# EAGLE design Libelle_SmallBoard (EAGLE 9.6.2)
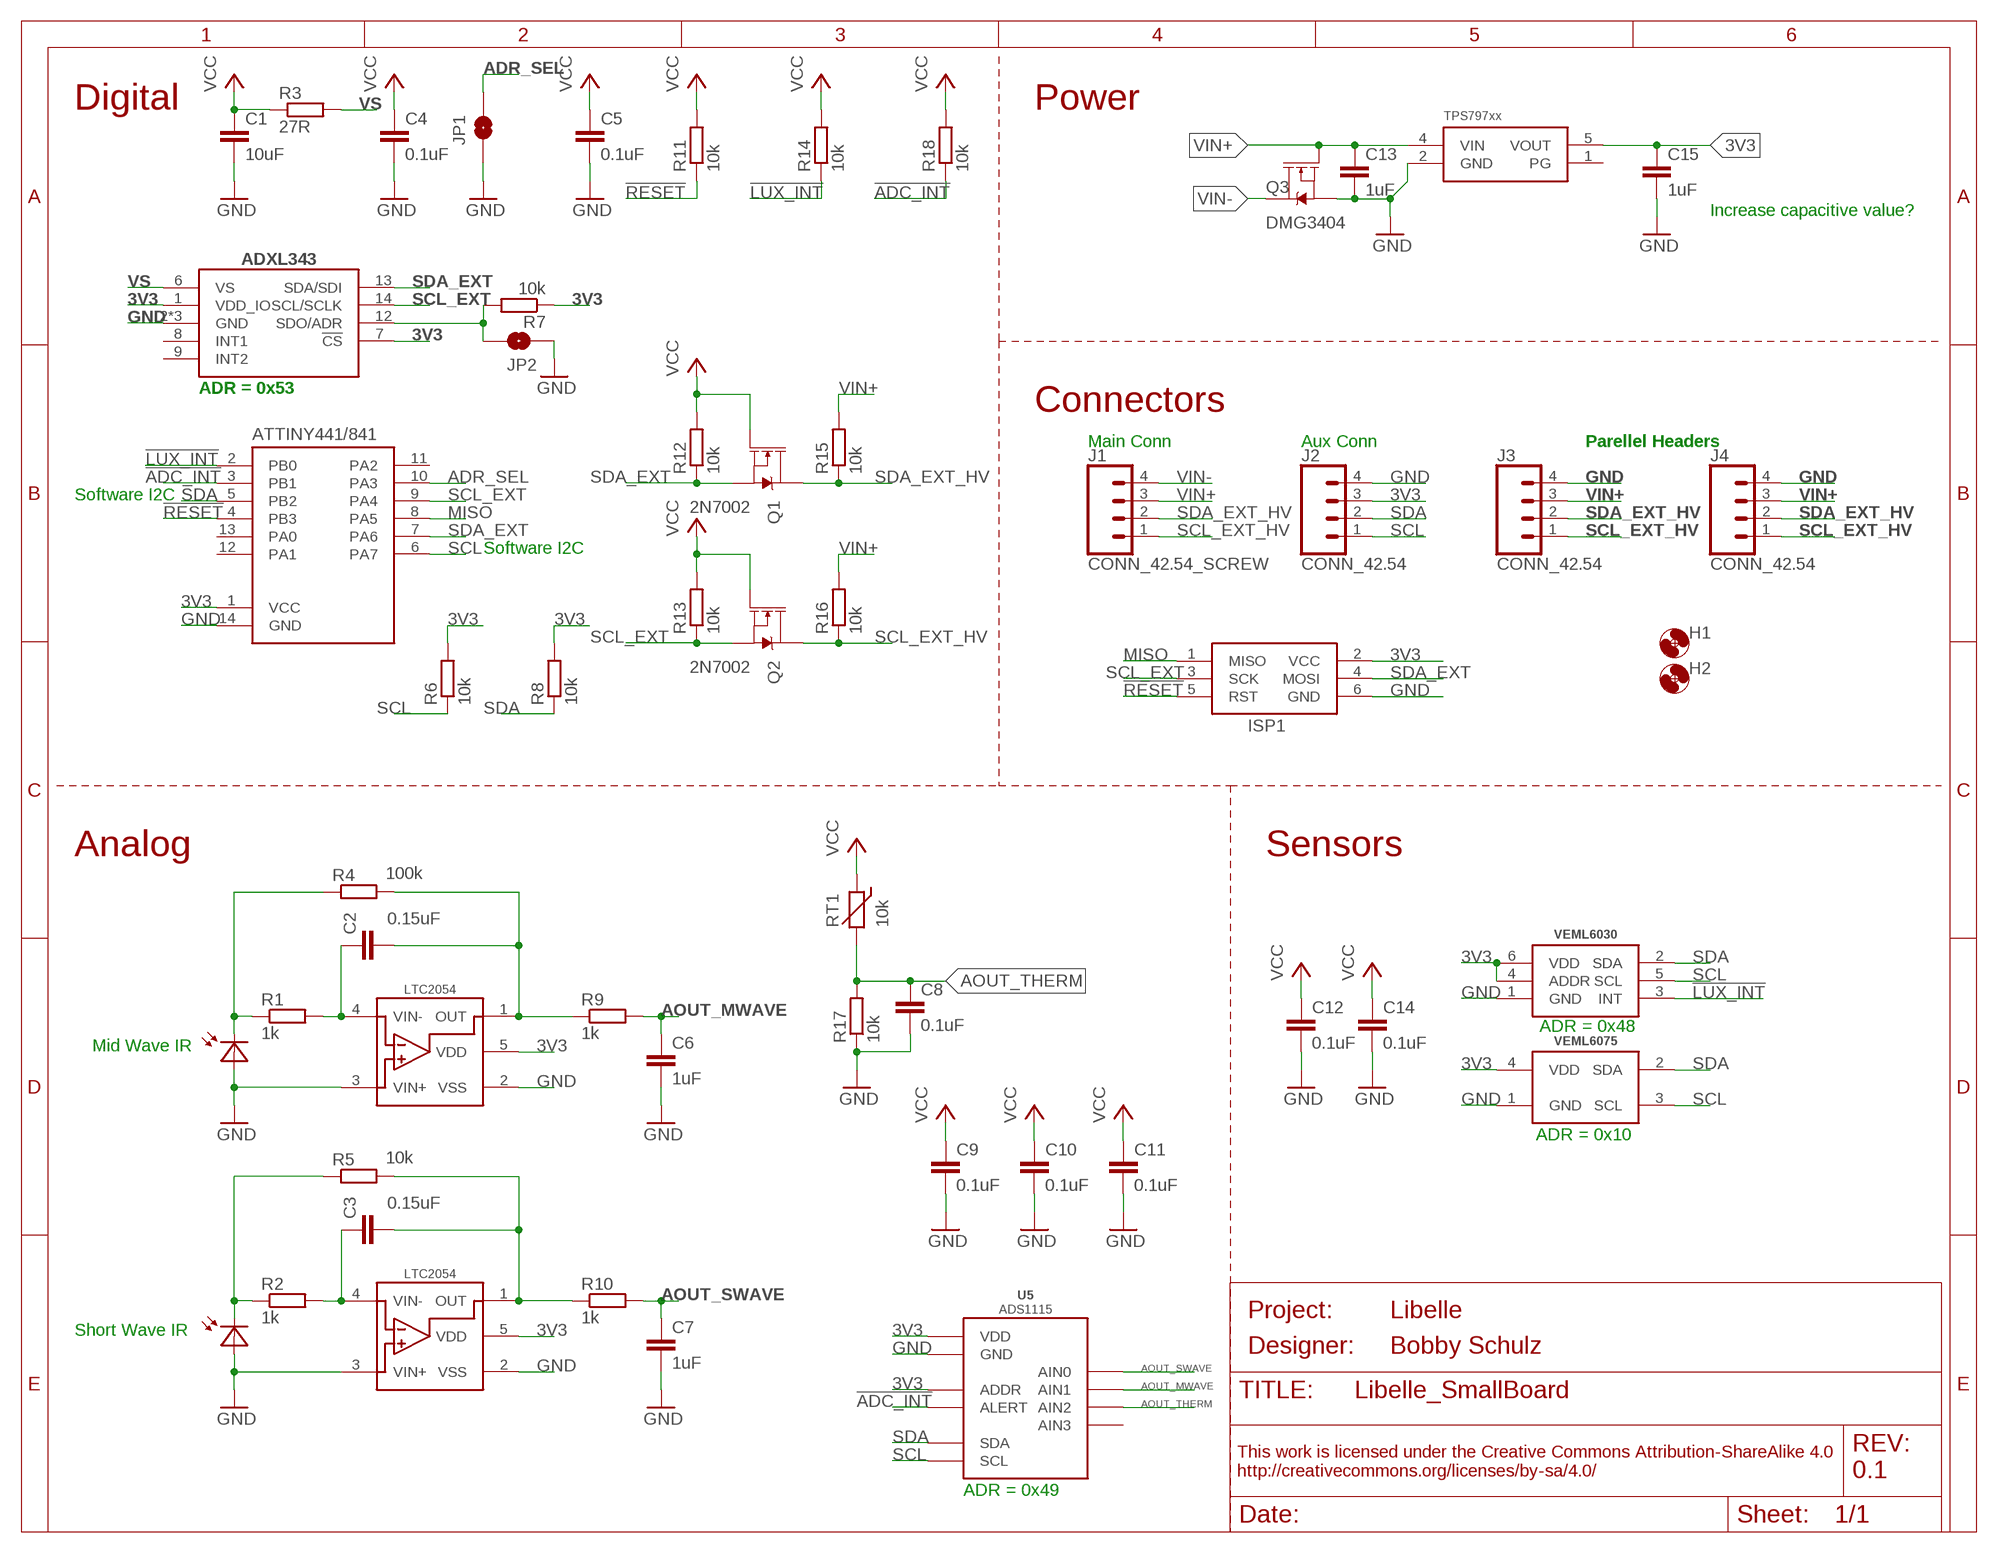
[diagram p0: schematic, sheet 1]
FRAME1 (FRAME_A_L): DESIGNER: Bobby Schulz; PROJECT: Libelle; REV: 0.1

## Parts
C1  10uF  C-EU10UFC0805  [C0805]
C2  0.15uF  C-EU0.15UFC0603  [C0603]
C3  0.15uF  C-EU0.15UFC0603  [C0603]
C4  0.1uF  C-EU0.1UFC0603  [C0603]
C5  0.1uF  C-EU0.1UFC0603  [C0603]
C6  1uF  C-EU1UFC0603  [C0603]
C7  1uF  C-EU1UFC0603  [C0603]
C8  0.1uF  C-EU0.1UFC0603  [C0603]
C9  0.1uF  C-EU0.1UFC0603  [C0603]
C10  0.1uF  C-EU0.1UFC0603  [C0603]
C11  0.1uF  C-EU0.1UFC0603  [C0603]
C12  0.1uF  C-EU0.1UFC0603  [C0603]
C13  1uF  C-EU1UFC0603  [C0603]
C14  0.1uF  C-EU0.1UFC0603  [C0603]
C15  1uF  C-EU1UFC0603  [C0603]
D1  PHOTODIODESD003-151-001  [D1206]
D2  PHOTODIODEVEMD1060  [D0805]
H1  MOUNTING_HOLE4_NP  [4_40]
H2  MOUNTING_HOLE4_NP  [4_40]
ISP1  AVRISP-6  [AVRISP]
J1  CONN_42.54_SCREW  [1X04_SCREW]
J2  CONN_42.54  [1X04]
J3  CONN_42.54  [1X04]
J4  CONN_42.54  [1X04]
JP1  JUMPER-SMT_2_NO_SILK  [SMT-JUMPER_2_NO_SILK]
JP2  JUMPER-SMT_2_NO_SILK  [SMT-JUMPER_2_NO_SILK]
Q1  2N7002  MOSFET-NCH-2N7002PW  [SOT323]
Q2  2N7002  MOSFET-NCH-2N7002PW  [SOT323]
Q3  DMG3404  MOSFET-NCH-DMG3404L  [SOT23-3]
R1  1k  R-EU_P1KR0603  [R0603]
R2  1k  R-EU_P1KR0603  [R0603]
R3  27R  R-EU_27R0603  [R0603]
R4  100k  R-EU_P100KR0603  [R0603]
R5  10k  R-EU_P10KR0603  [R0603]
R6  10k  R-EU_10KR0603  [R0603]
R7  10k  R-EU_10KR0603  [R0603]
R8  10k  R-EU_10KR0603  [R0603]
R9  1k  R-EU_P1KR0603  [R0603]
R10  1k  R-EU_P1KR0603  [R0603]
R11  10k  R-EU_10KR0603  [R0603]
R12  10k  R-EU_10KR0603  [R0603]
R13  10k  R-EU_10KR0603  [R0603]
R14  10k  R-EU_10KR0603  [R0603]
R15  10k  R-EU_10KR0603  [R0603]
R16  10k  R-EU_10KR0603  [R0603]
R17  10k  R-EU_P10KR0603  [R0603]
R18  10k  R-EU_10KR0603  [R0603]
RT1  10k  THERMISTOR10K  [R0603]
U1  ADXL343  [LGA-14]
U2  ATTINY441/841841  [SOIC_14]
U3  LTC2054  [SOT23-5]
U4  LTC2054  [SOT23-5]
U5  ADS1115  [VSSOP_10]
U6  TPS79733  [DCK_R-PDSO-G5]
U7  VEML6030  [VEML6030]
U8  VEML6075  [VEML6075]

## Nets
3V3: C1.1 C4.1 C5.1 C9.1 C10.1 C11.1 C12.1 C14.1 C15.1 ISP1.2(VCC) J2.3 Q1.1(G) Q2.1(G) R3.1 R6.2 R7.1 R8.2 R11.2 R12.2 R13.2 R14.2 R18.2 RT1.1 U1.1(VDD_IO) U1.7(!CS) U2.1(VCC) U3.5(VDD) U4.5(VDD) U5.1(ADDR) U5.8(VDD) U6.5(VOUT) U7.4(ADDR) U7.6(VDD) U8.4(VDD) ; supply symbol labelled VCC
!ADC_INT: R18.1 U2.3(PB1) U5.2(ALERT)
!LUX_INT: R14.1 U2.2(PB0) U7.3(INT)
!RESET: ISP1.5(RST) R11.1 U2.4(PB3)
ADR_SEL: JP1.2 U2.10(PA3)
AOUT_MWAVE: C6.1 R9.2 U5.5(AIN1)
AOUT_SWAVE: C7.1 R10.2 U5.4(AIN0)
AOUT_THERM: C8.1 R17.2 RT1.2 U5.6(AIN2)
GND: C1.2 C4.2 C5.2 C6.2 C7.2 C8.2 C9.2 C10.2 C11.2 C12.2 C13.2 C14.2 C15.2 D1.A D2.A ISP1.6(GND) J2.4 J3.4 J4.4 JP1.1 JP2.1 Q3.2(S) R17.1 U1.2(GND) U1.4(GND) U1.5(GND) U2.14(GND) U3.2(VSS) U3.3(VIN+) U4.2(VSS) U4.3(VIN+) U5.3(GND) U6.2(GND) U7.1(GND) U8.1(GND)
MISO: ISP1.1(MISO) U2.8(PA5)
N$1: JP2.2 R7.2 U1.12(SDO/ADR)
N$8: C3.1 R2.2 U4.4(VIN-)
N$9: D2.C R2.1 R5.1
N$10: D1.C R1.1 R4.1
N$11: C2.1 R1.2 U3.4(VIN-)
N$12: C2.2 R4.2 R9.1 U3.1(OUT)
N$13: C3.2 R5.2 R10.1 U4.1(OUT)
SCL: J2.1 R6.1 U2.6(PA7) U5.10(SCL) U7.5(SCL) U8.3(SCL)
SCL_EXT: ISP1.3(SCK) Q2.2(S) R13.1 U1.14(SCL/SCLK) U2.9(PA4)
SCL_EXT_HV: J1.1 J3.1 J4.1 Q2.3(D) R16.1
SDA: J2.2 R8.1 U2.5(PB2) U5.9(SDA) U7.2(SDA) U8.2(SDA)
SDA_EXT: ISP1.4(MOSI) Q1.2(S) R12.1 U1.13(SDA/SDI) U2.7(PA6)
SDA_EXT_HV: J1.2 J3.2 J4.2 Q1.3(D) R15.1
VIN+: C13.1 J1.3 J3.3 J4.3 Q3.1(G) R15.2 R16.2 U6.4(VIN)
VIN-: J1.4 Q3.3(D)
VS: R3.2 U1.6(VS)
Unconnected: U1.8(INT1) U1.9(INT2) U2.11(PA2) U2.12(PA1) U2.13(PA0) U5.7(AIN3) U6.1(PG)

## Notes on the sheet
- Digital | Power
- Increase capacitive value?
- ADR = 0x53
- Connectors
- Main Conn | Aux Conn | Parellel Headers
- Software I2C
- Software I2C
- Analog | Sensors
- ADR = 0x48
- Mid Wave IR
- ADR = 0x10
- Short Wave IR
- ADR = 0x49

## Library data of the parts
C1 = bschulz_passives:C-EU: CAPACITOR, European symbol; DIGIKEY: 490-6473-6-ND; MF: Murata; MPN: GRM21BR61C106KE15K
C2 C3 = bschulz_passives:C-EU: CAPACITOR, European symbol; DIGIKEY: 732-7990-1-ND; MF: Wurth; MPN: 885012206072
C4 C5 C8-C12 C14 = bschulz_passives:C-EU: CAPACITOR, European symbol; DIGIKEY: 490-6051-1-ND; MF: Murata; MPN: GCM188R71E104KA57D
C6 C7 C13 C15 = bschulz_passives:C-EU: CAPACITOR, European symbol; DIGIKEY: 1276-6524-1-ND; MF: Samsung; MPN: 1276-6524-1-ND
D1 = bschulz:PHOTODIODE: Photodiode MTD5010W: Short Wave IR Digikey: 1125-1007-ND <https://www.digikey.com/scripts/DkSearch/dksus.dll?Detail&itemSeq=258192291&uq=636602773549175498> SD003-151-001: Mid Wave IR Digikey: SD003-151-001CT-ND <https://www.digikey.com/scripts/DkSearch/dksus.dll?Detail&itemSeq=258196799&uq=636602773549175498> VEMD1060: Short Wave IR Digikey: VEMD1060X01CT-ND <https://www.digikey.com/scripts/DkSearch/dksus.dll?Detail&itemSeq=259283146&uq=636604381250884280>; DIGIKEY: SD003-151-001CT-ND; MF: Luna Opto; MPN: SD003-151-001
D2 = bschulz:PHOTODIODE: Photodiode MTD5010W: Short Wave IR Digikey: 1125-1007-ND <https://www.digikey.com/scripts/DkSearch/dksus.dll?Detail&itemSeq=258192291&uq=636602773549175498> SD003-151-001: Mid Wave IR Digikey: SD003-151-001CT-ND <https://www.digikey.com/scripts/DkSearch/dksus.dll?Detail&itemSeq=258196799&uq=636602773549175498> VEMD1060: Short Wave IR Digikey: VEMD1060X01CT-ND <https://www.digikey.com/scripts/DkSearch/dksus.dll?Detail&itemSeq=259283146&uq=636604381250884280>; DIGIKEY: VEMD1060X01CT-ND; MF: Vishay; MPN: VEMD1060X01
H1 H2 = bschulz:MOUNTING_HOLE: Genaric Mechanical Mounting Hole Hole diameter based on max body diameter + 15% Keepout ring is for diameter of socket cap screw (minimum required clearance) TPlace ring is for diameter of pan head screw (recomended clearance) Specifications: Socket Cap <http://fastener-express.com/fastener-technical/SocketscapSS-Alloy.pdf> Button Head Socket Cap <http://fastener-express.com/fastener-technical/Button-Socket-alloy.pdf> Pan Head <http://fastener-express.com/fastener-technical/pan-machine-Screws.pdf>
ISP1 = bschulz:AVRISP: AVR ISP HEADER Standard 6 pin header for AVR programming
J1 = bschulz:CONN_4: Genaric 4 pin connector; DIGIKEY: ED10563-ND; MF: On Shore; MPN: OSTVN04A150
J2-J4 = bschulz:CONN_4: Genaric 4 pin connector
JP1 JP2 = SparkFun-Jumpers:JUMPER-SMT_2_NO: Normally open jumper This jumper has two pads in close proximity to each other. Apply solder to close the connection. Round pads are easier to solder for beginners, but are a lot larger. SparkFun Product that uses the round pads: SparkFun EL Sequencer <https://www.sparkfun.com/products/12781>
Q1 Q2 = bschulz:MOSFET-NCH: N-channel MOSFETs Voltage controlled devices that allow control of high current outputs. SparkFun Products: SparkFun OpenScale <https://www.sparkfun.com/products/13261> SparkFun Digital Sandbox <https://www.sparkfun.com/products/12651> SparkFun Monster Moto Shield <https://www.sparkfun.com/products/10182> SparkFun MOSFET Power Controller <https://www.sparkfun.com/products/11214>; DIGIKEY: 2N7002W-FDICT-ND; MF: Diodes Incorporated; MPN: 2N7002W-7-F; PROD_ID: TRANS-11151
Q3 = bschulz:MOSFET-NCH: N-channel MOSFETs Voltage controlled devices that allow control of high current outputs. SparkFun Products: SparkFun OpenScale <https://www.sparkfun.com/products/13261> SparkFun Digital Sandbox <https://www.sparkfun.com/products/12651> SparkFun Monster Moto Shield <https://www.sparkfun.com/products/10182> SparkFun MOSFET Power Controller <https://www.sparkfun.com/products/11214>; DIGIKEY: DMG3404L-7DICT-ND; MF: Diodes Incorporated; MPN: DMG3404L-7
R1 R2 R9 R10 = bschulz_passives:R-EU_: RESISTOR, European symbol; DIGIKEY: P1.0KDBCT-ND; MF: Panasonic; MPN: ERA-3AEB102V; VALUE_PART: 1k
R3 = bschulz:R-EU_: RESISTOR, European symbol; DIGIKEY: 311-27.0HRCT-ND; MF: Yageo; MPN: RC0603FR-0727RL; VALUE_PART: 27
R4 = bschulz_passives:R-EU_: RESISTOR, European symbol; DIGIKEY: P100KDBCT-ND; MF: Panasonic; MPN: ERA-3AEB104V; VALUE_PART: 100k
R5 R17 = bschulz_passives:R-EU_: RESISTOR, European symbol; DIGIKEY: P10KDBCT-ND; MF: Panasonic; MPN: ERA-3AEB103V; VALUE_PART: 10k
R6-R8 R11-R16 R18 = bschulz_passives:R-EU_: RESISTOR, European symbol; DIGIKEY: P10.0KHCT-ND; MF: Panasonic; MPN: ERJ-3EKF1002V; VALUE_PART: 10k
RT1 = bschulz:THERMISTOR: Thermistor NTC Thermistors: Digikey = 490-12101-1-ND, R25 = 47K, Package = 0603 Digikey = 490-16279-1-ND, R25 = 10K, Package = 0603; DIGIKEY: 490-16279-1-ND; MF: Murata; MPN: NCU18XH103F60RB
U1 = bschulz:ADXL343: ADXL343 - Digital Accelerometer(I2C/SPI) Characteristics: Vcc: 2V ~ 3.6V Acceleration Range: ±2g, ±4g, ±8g, ±16g Sensitivity: 256 ~ 32 LSB/g (±2g ~ ± 16g) Bandwidth: 0.05Hz ~ 1.6kHz Operating Temperature: -40°C to 85°C Digikey: ADXL343BCCZ-ND <https://www.digikey.com/product-detail/en/analog-devices-inc/ADXL343BCCZ/ADXL343BCCZ-ND/3542918>; DIGIKEY: ADXL343BCCZ-ND; MF: Analog Devices; MPN: ADXL343BCCZ
U2 = bschulz:ATTINY441/841: ATTINY441, ATTINY841 8 bit MCU, 4/8k flash, 256/512B SRAM; DIGIKEY: ATTINY841-SSU-ND; MF: Atmel; MPN: ATTINY841-SSU
U3 U4 = bschulz:LTC2054: LTC2054 -Single Micropower Zero Drift Op-Amp Characteristics: Vs: 2.7 ~ 6V (2.7 ~ +/- 5.5V for LTC2054HV) Iq: 175uA GBP: 500kHz PSSR: 130dB CMMR: 130dB Operating Temperature: -40°C to 85°C Digikey: LTC2054CS5#TRPBFCT-ND <https://www.digikey.com/scripts/DkSearch/dksus.dll?Detail&itemSeq=258611552&uq=636603257096973101> LTC2054HVIS5#TRMPBFCT-ND (High Voltage Variant) <https://www.digikey.com/product-detail/en/linear-technology-analog-devices/LTC2054HVIS5-TRMPBF/LTC2054HVIS5-TRMPBFCT-ND/3830416>; DIGIKEY: LTC2054HS5#TRMPBFCT-ND; DISP: LTC2054; MF: LT; MPN: LTC2054HS5#TRMPBF
U5 = bschulz:ADS111*: ADS1115 - Sigma Delta ADC Characteristics: VCC: 2~5.5V Resolution: 16 bits (12 bits for ADS1015) Number of Inputs: 4 (2 Differenital) Sample Rate: 860 Samples Per Second (3300 for ADS1015) Operating Temperature: -40°C to 125°C Digikey: 296-38849-1-ND (ADS1115) <https://www.digikey.com/scripts/DkSearch/dksus.dll?Detail&itemSeq=258904888&uq=636603311183646020> 296-41185-1-ND (ADS1015) <https://www.digikey.com/product-detail/en/texas-instruments/ADS1015IDGSR/296-41185-1-ND/5222640>; DIGIKEY: 296-38849-1-ND; MF: TI; MPN: ADS1115IDGSR
U6 = bschulz:TPS797*: TPS797xx, Ultra low power linear voltage regulator, fixed voltages of 1.8v, 3v, 3.3v Input voltage rage of 1.8-5.5v; DIGIKEY: 296-11990-1-ND; MF: TI; MPN: TPS79733DCKR
U7 = bschulz:VEML6030: VEML6030 - Ambient Light Sensor with I2C Interface Characteristics: VCC: 2.5~3.6V Operating Temperature: -40°C to 85°C Ambient Light Range: 0 ~ 120,000 Lux Digikey: VEML6030-GS15CT-ND <https://www.digikey.com/product-detail/en/vishay-semiconductor-opto-division/VEML6030-GS15/VEML6030-GS15CT-ND/6221151>; DIGIKEY: VEML6030-GS15CT-ND; MF: Vishay; MPN: VEML6030-GS15
U8 = bschulz:VEML6075: VEML6075 - UVA and UVB Light Sensor with I2C Interface Characteristics: VCC: 1.7~3.6V Operating Temperature: -40°C to 85°C Spectral Range: 300 ~ 400 nm Digikey: VEML6075CT-ND <https://www.digikey.com/scripts/DkSearch/dksus.dll?Detail&itemSeq=258192091&uq=636598415319231969>; DIGIKEY: VEML6075CT-ND; MF: Vishay; MPN: VEML6075

## Board
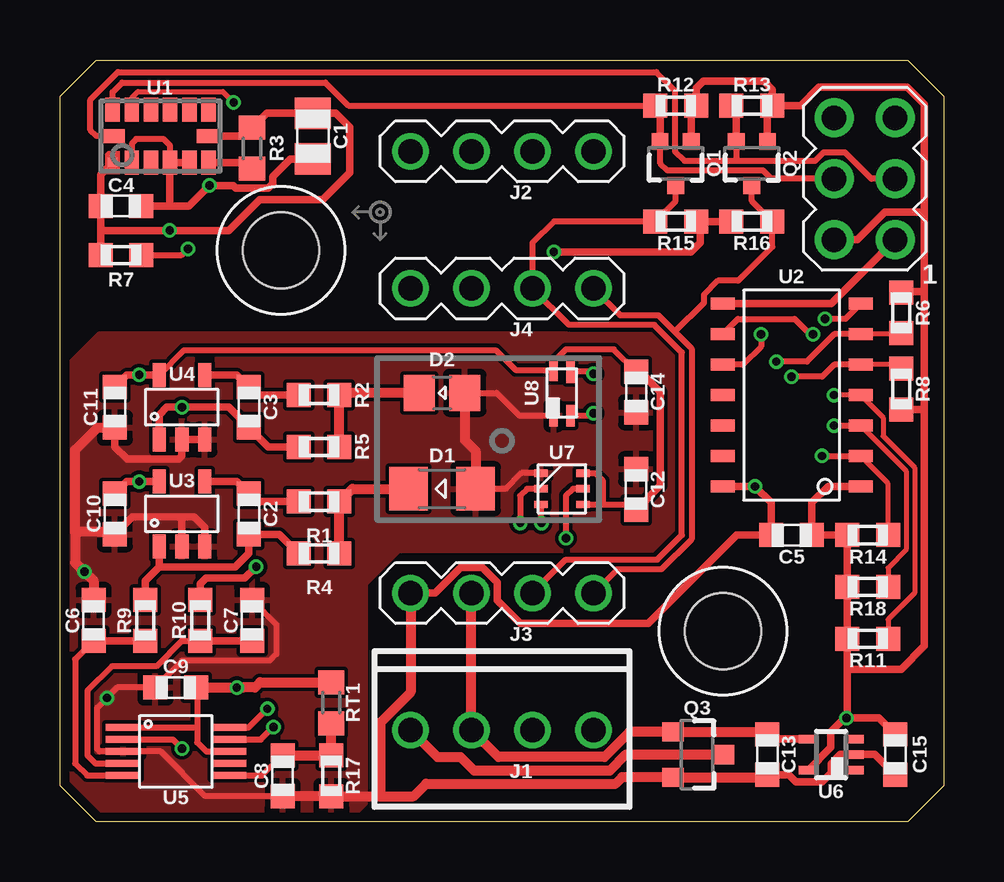
[diagram p1: board, top side]
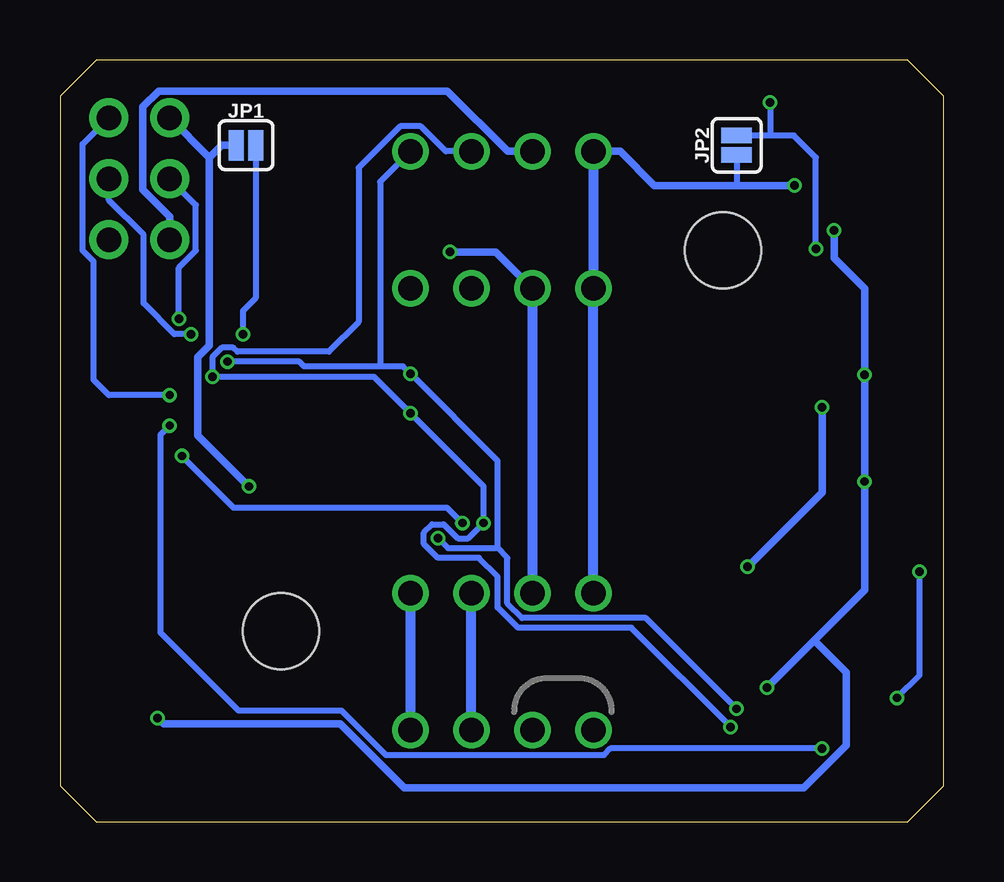
[diagram p2: board, bottom side, seen from below]

Size 36.83 x 31.75 mm. Coordinates in mm from the lower left corner, seen from the top.
Outline: 35.33,0 1.5,0 0,1.5 0,30.25 1.5,31.75 35.33,31.75 36.83,30.25 36.83,1.5 35.33,0
Copper layers (1*16): Top 0.035559375mm / dielectric 1.6mm / Bottom 0.035559375mm
Design rules "oshpark-2layer": minimum track width 6mil, minimum drill 10mil, track to track 6mil, track to pad 6mil, pad to pad 6mil, via to via 6mil, smd to smd 6mil, copper to edge 15mil, drill to drill 6mil, minimum pad ring 5mil, minimum via ring 5mil, stop-mask expansion 2.5mil, vias tented up to drill 0mil, thermal gap 10mil

### Footprints (pad centres in the part's own frame; a part is rotated, then mirrored left to right if it is on the bottom)
C0805 = smd 1.3 x 1.5: 1 -0.95,0; 2 0.95,0
C0603 = smd 1 x 1: 1 -0.85,0; 2 0.85,0
D1206 = smd 1.6 x 1.8: A 1.4,0; C -1.4,0
D0805 = smd 1.3 x 1.5: A 0.95,0; C -0.95,0
4_40 = hole 3.175: 0,0
AVRISP = drill 1.02 pad 1.626: 1 -1.27,2.54; 2 1.27,2.54; 3 -1.27,0; 4 1.27,0; 5 -1.27,-2.54; 6 1.27,-2.54
1X04_SCREW = drill 1.016: 1 -3.81,0; 2 -1.27,0; 3 1.27,0; 4 3.81,0
1X04 = drill 1.016: 1 -3.81,0; 2 -1.27,0; 3 1.27,0; 4 3.81,0
SMT-JUMPER_2_NO_SILK = smd 0.635 x 1.27: 1 -0.406,0; 2 0.406,0
SOT323 = smd 0.7 x 0.7: 1 -0.65,-0.925; 2 0.65,-0.925; 3 0,0.925
SOT23-3 = smd 0.8 x 0.9: 1 -0.95,-1; 2 0.95,-1; 3 0,1.1
R0603 = smd 1 x 1: 1 -0.85,0; 2 0.85,0
R0603' = smd 1 x 1.1: 1 -0.85,0; 2 0.85,0
LGA-14 = smd 0.4 x 0.4: 1 -2,-1.1 | smd 0.6 x 1: 2 -1.2,-1.1; 3 -0.4,-1.1; 4 0.4,-1.1; 5 1.2,-1.1; 6 2,-1.1; 8 2,1.1; 9 1.2,1.1; 10 0.4,1.1; 11 -0.4,1.1; 12 -1.2,1.1; 13 -2,1.1 | smd 1 x 0.6: 7 2,0; 14 -2,0
SOIC_14 = smd 0.5 x 1: 1 -3.81,-2.875; 2 -2.54,-2.875; 3 -1.27,-2.875; 4 0,-2.875; 5 1.27,-2.875; 6 2.54,-2.875; 7 3.81,-2.875; 8 3.81,2.875; 9 2.54,2.875; 10 1.27,2.875; 11 0,2.875; 12 -1.27,2.875; 13 -2.54,2.875; 14 -3.81,2.875
SOT23-5 = smd 0.55 x 1: 1 -0.95,-1.35; 2 0,-1.35; 3 0.95,-1.35; 4 0.95,1.35; 5 -0.95,1.35
VSSOP_10 = smd 0.3 x 1.45: 1 -1,-2.2; 2 -0.5,-2.2; 3 0,-2.2; 4 0.5,-2.2; 5 1,-2.2; 6 1,2.2; 7 0.5,2.2; 8 0,2.2; 9 -0.5,2.2; 10 -1,2.2
DCK_R-PDSO-G5 = smd 0.35 x 0.8: 1 -0.65,-0.95; 2 0,-0.95; 3 0.65,-0.95; 4 0.65,0.95; 5 -0.65,0.95
VEML6030 = smd 0.55 x 0.3: 1 -0.875,0.65; 2 -0.875,0; 3 -0.875,-0.65; 4 0.875,-0.65; 5 0.875,0; 6 0.875,0.65
VEML6075 = smd 0.9 x 0.35: 1 -0.95,0.35; 2 -0.95,-0.35; 4 0.95,0.35 | smd 1 x 0.35: 3 0.9,-0.35

### Placement (x,y rotation side)
C1  10.54,28.57 270 top
C2  7.87,12.83 270 top
C3  7.87,17.27 270 top
C4  2.54,25.65 0 top
C5  30.48,11.94 180 top
C6  1.4,8.38 90 top
C7  8,8.38 90 top
C8  9.27,1.91 270 top
C9  4.83,5.59 180 top
C10  2.29,12.83 270 top
C11  2.29,17.27 270 top
C12  24,13.84 90 top
C13  29.46,2.79 270 top
C14  24,17.91 270 top
C15  34.8,2.79 270 top
D1  15.91,13.88 0 top
D2  15.91,17.88 0 top
H1  27.62,7.94 0 top
H2  9.21,23.81 0 top
ISP1  33.53,26.8 180 top
J1  18.41,3.81 180 top
J2  18.41,27.95 180 top
J3  18.41,9.53 180 top
J4  18.41,22.23 180 top
JP1  29.08,28.19 0 bottom
JP2  8.64,28.19 90 bottom
Q1  25.65,27.43 180 top
Q2  28.83,27.43 180 top
Q3  26.54,2.79 270 top
R1  10.79,13.34 180 top
R2  10.79,17.78 180 top
R3  27R  [R0603']  8,28.07 270 top
R4  10.79,11.18 180 top
R5  10.79,15.62 180 top
R6  35.05,21.21 90 top
R7  2.54,23.62 0 top
R8  35.05,18.03 270 top
R9  3.56,8.38 270 top
R10  5.84,8.38 270 top
R11  33.66,7.62 180 top
R12  25.65,29.84 0 top
R13  28.83,29.84 0 top
R14  33.66,11.94 180 top
R15  25.65,25.02 0 top
R16  28.83,25.02 180 top
R17  11.3,1.91 90 top
R18  33.66,9.78 180 top
RT1  10k  [R0603']  11.3,4.95 270 top
U1  4.19,28.57 0 top
U2  30.48,17.78 90 top
U3  5.08,12.83 0 top
U4  5.08,17.27 0 top
U5  4.83,2.92 270 top
U6  32.13,2.79 90 top
U7  20.91,13.88 0 top
U8  20.91,17.88 90 top

### Tracks (layer width: path | path; a pad name or v marks a point on that pad's centre or on a via)
3V3  (via drill 0.35)
  Top 0.254: C9.1 5.71,5.55 5.71,3.94 | 5.71,3.94 5.71,3.3 6.1,2.92 U5.8 | U5.1 5.7,3.92 5.71,3.94 | U7.4 22.61,13.22 | 22.61,13.22 23.77,13.22 C12.1 | C14.1 23.07,19.68 21.08,19.68 20.57,19.17 U8.4 18.98,18.82 18.15,19.66 5.16,19.66 U4.5 | U7.6 22.3,14.53 22.61,14.22 22.61,13.22
  Top 0.305: U4.5 v3.3,18.62 2.79,18.62 C11.1 | U3.5 v3.3,14.18 2.79,14.18 C10.1 | 7.62,5.59 v7.37,5.59 | U6.5 32.12,3.08 32.12,3.75 32.73,4.36 32.8,4.36 | U2.1 32,13.97 31.33,13.3 C5.1 R14.2 R18.2 R11.2 | ISP1.2 33.22,24.26 34.36,25.4 36.02,25.4 | Q1.1 26.3,29.64 R12.2 26.5,30.57 26.8,30.86 29.34,30.86 29.68,30.52 R13.2 | Q2.1 29.48,29.64 R13.2 | C4.1 1.69,26.97 U1.1 | R13.2 30.86,29.84 31.62,30.61 35.31,30.61 36.02,29.9 36.02,25.4 | C4.1 1.91,25.65 | C12.1 25.02,14.01 25.02,17.91 24.17,18.76 C14.1 | C4.1 1.69,24.64 | 1.69,24.64 R7.1 | 1.69,24.64 v4.57,24.64 7.03,24.64 8.33,25.93 10.95,25.93 12.06,27.05 12.06,28.96 11.5,29.52 C1.1 8.61,29.52 R3.1 7.66,28.57 U1.7 | R11.2 32.57,7.38 | R11.2 32.8,6.35 | 32.8,6.35 32.8,4.36 | 32.8,4.36 v32.77,4.32 34.12,4.32 C15.1 | 32.8,6.35 35.05,6.35 36.02,7.31 36.02,17.14 | 36.02,17.14 36.02,22.1 | 36.02,22.1 36.02,25.4 | R6.2 35.09,22.1 36.02,22.1 | R8.2 35.98,17.18 36.02,17.14
  Top 0.406: C9.1 v7.37,5.59 | 7.62,5.59 8.13,5.59 8.34,5.8 RT1.1
  Bottom 0.305: v7.37,5.59 5.4,7.56 | 5.4,7.56 3.3,9.65 v3.3,14.18 v3.3,18.62 3.3,22.23 4.57,23.5 v4.57,24.64 | 5.4,7.56 4.06,6.22 4.06,3.17 5.84,1.4 22.48,1.4 25.15,4.06 32.51,4.06 v32.77,4.32 | J2.3 18.18,27.95 20.69,30.45 32.72,30.45 33.38,29.8 33.38,26.33 32.26,25.22 ISP1.2
!ADC_INT  (via drill 0.35)
  Top 0.2: R18.1 34.51,10.58 35.26,11.33 35.26,14.61 U2.3
  Top 0.254: U5.2 4.71,3.42 v5.08,3.05 | v32.26,16.51 U2.3
  Bottom 0.254: v5.08,3.05 13.89,3.05 14.17,2.77 23.24,2.77 25.09,4.62 29.39,4.62 32.64,7.87 32.64,16.13 v32.26,16.51
!LUX_INT  (via drill 0.35)
  Top 0.2: R14.1 34.51,14.09 U2.2
  Top 0.254: U7.3 20.04,12.47 v20.07,12.45 | v31.75,15.24 U2.2
  Bottom 0.254: 20.26,12.45 v20.07,12.45 20.7,13.08 29.59,13.08 v31.75,15.24
!RESET  (via drill 0.35)
  Top 0.2: R11.1 34.51,8.42 35.61,9.53 35.61,14.75 34.3,16.06 34.3,16.84 U2.4 v32.26,17.78
  Bottom 0.254: ISP1.5 35.89,28.25 35.89,23.8 35.43,23.35 35.43,18.41 34.8,17.78 v32.26,17.78
ADR_SEL  (via drill 0.35)
  Top 0.254: v29.21,20.32 29.21,19.81 28.45,19.05 U2.10
  Bottom 0.254: JP1.2 28.68,21.82 29.21,21.29 v29.21,20.32
AOUT_MWAVE
  Top 0.254: R9.2 3.64,7.53 | C6.1 0.64,6.77 0.64,2.41 1.13,1.92 U5.5
  Top 0.305: C6.1 R9.2
AOUT_SWAVE
  Top 0.254: U5.4 1.48,2.42 1.14,2.75 1.14,5.46 2.16,6.48 4.03,6.48 5.08,7.53 R10.2
  Top 0.305: R10.2 C7.1
AOUT_THERM
  Top 0.254: U5.6 8.44,1.92 C8.1
  Top 0.406: RT1.2 R17.2 C8.1
GND  (via drill 0.35)
  Top 0.254: C8.2 6.06,1.05 4.19,2.92 U5.3 1.65,2.92 1.55,3.02 1.55,4.75 v1.96,5.16 2.39,5.59 C9.2 5.09,6.7 8.73,6.7 9.02,6.99 9.02,8.22 C7.2 | U7.1 19.22,14.53 18.57,13.88 D1.A | D2.A 18.19,17.88 19.14,16.93 U8.1 20.57,16.61 | U1.4 4.59,28.18 4.32,28.45 3.17,28.45 2.99,28.26 U1.2
  Top 0.305: C10.2 3.01,12.7 5.08,12.7 | U3.3 6.03,12.26 5.59,12.7 5.08,12.7 | U3.2 5.08,12.7 | 2.46,16.59 C11.2 2.29,15.62 2.79,15.11 4.95,15.11 5.08,15.24 U4.2 U4.3 | C13.2 30.38,1.94 30.66,1.66 31.76,1.66 32.13,2.03 32.13,2.41 32.51,2.79 U6.2 33.95,2.79 C15.2 | U2.14 v28.96,13.97 29.63,13.3 C5.2 28.19,11.94 24.51,8.26 19.18,8.26 18.21,9.22 18.21,9.97 17.59,10.59 16.7,10.59 15.64,9.53 J3.4 | U1.5 U1.4 4.57,27.46 4.57,25.65 | 4.57,25.65 C4.2 | C1.2 9.59,27.62 8.86,26.89 8.86,26.59 8.68,26.41 7.33,26.41 7.22,26.52 v6.22,26.52 5.36,25.65 4.57,25.65
  Top 0.406: 0.64,12.06 0.64,10.79 v1.02,10.41 1.4,10.03 C6.2 | C10.2 2.07,12.06 0.64,12.06 | C11.2 1.56,16.42 0.64,15.49 0.64,12.06 | C8.2 R17.1 13.34,1.05 | D2.A 16.86,15.9 17.32,15.45 D1.A | C13.2 29.36,1.84 Q3.2 23.42,1.84 23.15,1.57 15.26,1.57 14.74,1.05 13.34,1.05 | J3.4 14.61,5.39 13.34,4.12 13.34,1.05
  Bottom 0.254: v1.96,5.16 1.02,6.1 v1.02,10.41 | JP2.1 8.64,26.52
  Bottom 0.305: v6.22,26.52 8.64,26.52 12.06,26.52 13.49,27.95 J2.4 | ISP1.6 30.61,27.69 | v28.96,13.97 31.09,16.1 31.09,19.37 30.61,19.85 30.61,27.69 | JP1.1 30.1,28.19 30.61,27.69
  Bottom 0.406: J2.4 J4.4 J3.4
  pour Top: 0.38,19.05 1.65,20.32 24.64,20.32 25.53,19.43 25.53,12.19 24.64,11.3 14.1,11.3 12.7,9.91 12.7,0.76 12.06,0.13 1.4,0.13 0.38,1.14
MISO
  Top 0.305: ISP1.1 32.13,21.59 U2.8
N$1  (via drill 0.35)
  Top 0.2: U1.12 2.99,30.17 3.25,30.43 6.78,30.43 v7.24,29.97
  Top 0.254: R7.2 5.08,23.62 v5.33,23.88
  Bottom 0.254: v5.33,23.88 5.33,27.69 6.25,28.6 7.24,28.6 | 7.24,28.6 JP2.2 | v7.24,29.97 7.24,28.6
N$8
  Top 0.305: R2.2 8.22,17.78 C3.1 7.37,18.62 U4.4
N$9
  Top 0.406: D2.C 11.74,17.88 R2.1 R5.1
N$10
  Top 0.406: R4.1 R1.1 12.19,13.88 D1.C
N$11
  Top 0.305: U3.4 7.37,14.18 C2.1 8.22,13.34 R1.2
N$12
  Top 0.305: R9.1 3.56,10.03 4.13,10.61 | 4.13,10.61 U3.1 | 4.13,10.61 7.3,10.61 7.87,11.18 C2.2 9.14,11.98 R4.2
N$13  (via drill 0.35)
  Top 0.305: R5.2 8.68,15.62 C3.2 7.02,17.27 v5.08,17.27 4.45,17.27 4.13,16.96 U4.1 | R10.1 5.84,9.91 6.09,10.15 7.71,10.15 v8.18,10.62
  Bottom 0.305: v5.08,17.27 5.08,13.72 v8.18,10.62
SCL  (via drill 0.35)
  Top 0.2: R6.1 35.01,20.32 U2.6
  Top 0.254: U5.10 7.86,3.92 v8.64,4.7 | U8.3 22.12,18.77 v22.23,18.67 | U7.5 21.37,13.88 21.08,13.59 v21.08,11.81 | U2.6 32.26,20.32 31.11,19.18 v29.84,19.18
  Bottom 0.254: v29.84,19.18 26.86,19.18 26.66,18.98 23.5,18.98 | 23.5,18.98 22.53,18.98 v22.23,18.67 18.6,15.04 18.6,11.4 | v8.64,4.7 12.42,8.48 17.58,8.48 18.19,9.09 18.19,10.99 18.6,11.4 | v21.08,11.81 20.67,11.4 18.6,11.4 | J2.1 23.5,26.68 23.5,18.98
SCL_EXT  (via drill 0.35)
  Top 0.254: ISP1.3 33.8,26.8 32.71,27.89 31.81,27.89 31.46,27.54 28.19,27.54 | U1.14 1.52,28.57 1.27,28.83 1.27,30.1 2.41,31.24 24.85,31.24 25.63,30.46 25.63,27.93 26.02,27.54 28.19,27.54 | Q2.2 28.18,27.56 28.19,27.54 | U2.9 28.24,20.95 30.61,20.95 31.24,20.32 v31.37,20.32
  Top 0.305: Q2.2 28.18,29.64 R13.1
  Bottom 0.254: ISP1.3 34.8,25.91 33.35,24.46 33.35,21.61 32.06,20.32 v31.37,20.32
SCL_EXT_HV
  Top 0.254: Q2.3 28.83,25.87 R16.1 29.68,23.96 28.26,22.54 27.41,22.54 26.83,21.96 26.83,21.62 25.62,20.42 | 25.62,20.42 24.93,21.11 23.34,21.11 J4.1 | 25.62,20.42 26.31,19.73 26.31,11.77 25.06,10.52 23.22,10.52 J3.1
  Bottom 0.406: J1.1 J3.1
SDA  (via drill 0.35)
  Top 0.2: R8.1 34.89,19.05 33.15,19.05
  Top 0.254: U5.9 8.37,3.42 v8.89,3.94 | U8.2 22.13,16.93 v22.23,17.02 | U7.2 19.46,13.88 19.18,13.59 v19.18,12.45 | U2.5 33.15,19.05 32.26,19.05 31.75,18.54 v30.48,18.54
  Bottom 0.254: v8.89,3.94 13.03,8.08 17.75,8.08 18.59,8.93 18.59,10.21 19.37,10.99 21.08,10.99 21.66,11.57 21.66,12.05 21.32,12.39 20.84,12.39 20.25,11.8 19.82,11.8 v19.18,12.45 19.18,13.97 v22.23,17.02 23.75,18.54 v30.48,18.54 30.48,19.36 30.09,19.76 29.6,19.76 29.43,19.58 25.63,19.58 24.38,20.83 24.38,27.26 22.66,28.99 21.79,28.99 20.75,27.95 J2.2
SDA_EXT  (via drill 0.35)
  Top 0.254: ISP1.4 29.63,26.8 29.3,27.14 25.32,27.14 25.02,27.43 25.02,28.34 Q1.2 | R12.1 12.02,29.84 11.05,30.81 2.58,30.81 2.19,30.41 U1.13 | U2.7 32.72,20.95 v31.88,20.95
  Top 0.305: Q1.2 25,29.64 R12.1
  Bottom 0.254: v31.88,20.95 31.88,23.09 31.17,23.8 31.17,25.7 ISP1.4
SDA_EXT_HV
  Top 0.254: Q1.3 25.65,25.87 R15.1 22.86,25.02 22.48,25.02 20.57,25.02 19.68,24.13 J4.2 21.21,20.7 24.77,20.7 25.91,19.56 25.91,11.94 24.89,10.92 21.08,10.92 J3.2
  Bottom 0.406: J1.2 J3.2
VIN+  (via drill 0.35)
  Top 0.305: U6.4 29.66,3.44 C13.1 | R16.2 26.67,25.02 | 26.67,25.02 R15.2 | 26.67,25.02 26.67,24.13 26.29,23.75 v20.57,23.75
  Top 0.406: J3.3 J1.3 18.26,2.69 22.69,2.69 23.74,3.74 Q3.1 29.36,3.74 C13.1
  Bottom 0.305: v20.57,23.75 18.67,23.75 J4.3
  Bottom 0.406: J4.3 J3.3
VIN-
  Top 0.406: Q3.3 23.58,2.79 22.92,2.13 17.24,2.13 16.68,2.69 15.72,2.69 J1.4
VS
  Top 0.305: U1.6 7.74,27.48 R3.2

### Text on the board
tDocu: x | z | AUX | y | IR SW | UV | IR MW | Vis
bDocu: J1 | GND | 3v3 | SDA | SCL | J0 | AUX | Project Libelle v0.1 / ShortWave / ---------------- / Developed by / Northern Widget and / University of Minnesota | To Logger | 3.3v ~ 5v | ± | GND | Vin | SDA | SCL